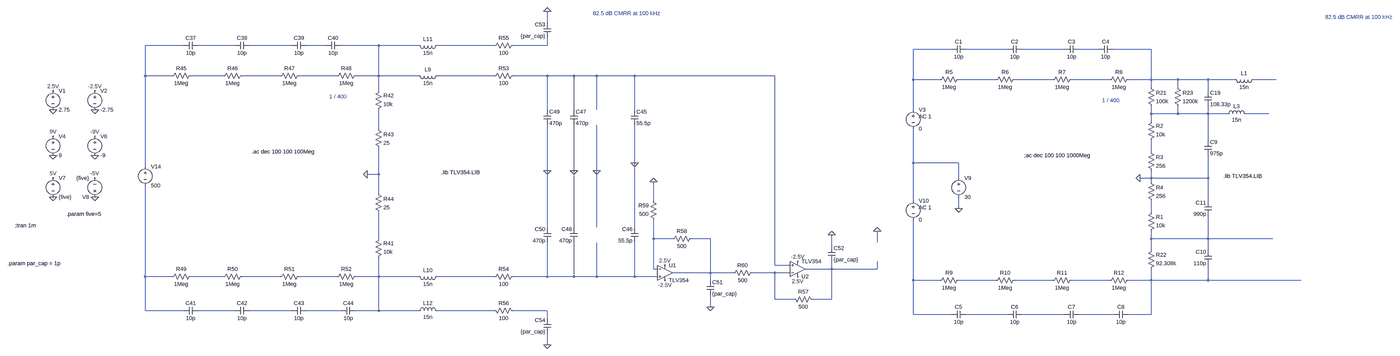
[diagram p0: schematic ratio_analysis_ac.asc, whole sheet]
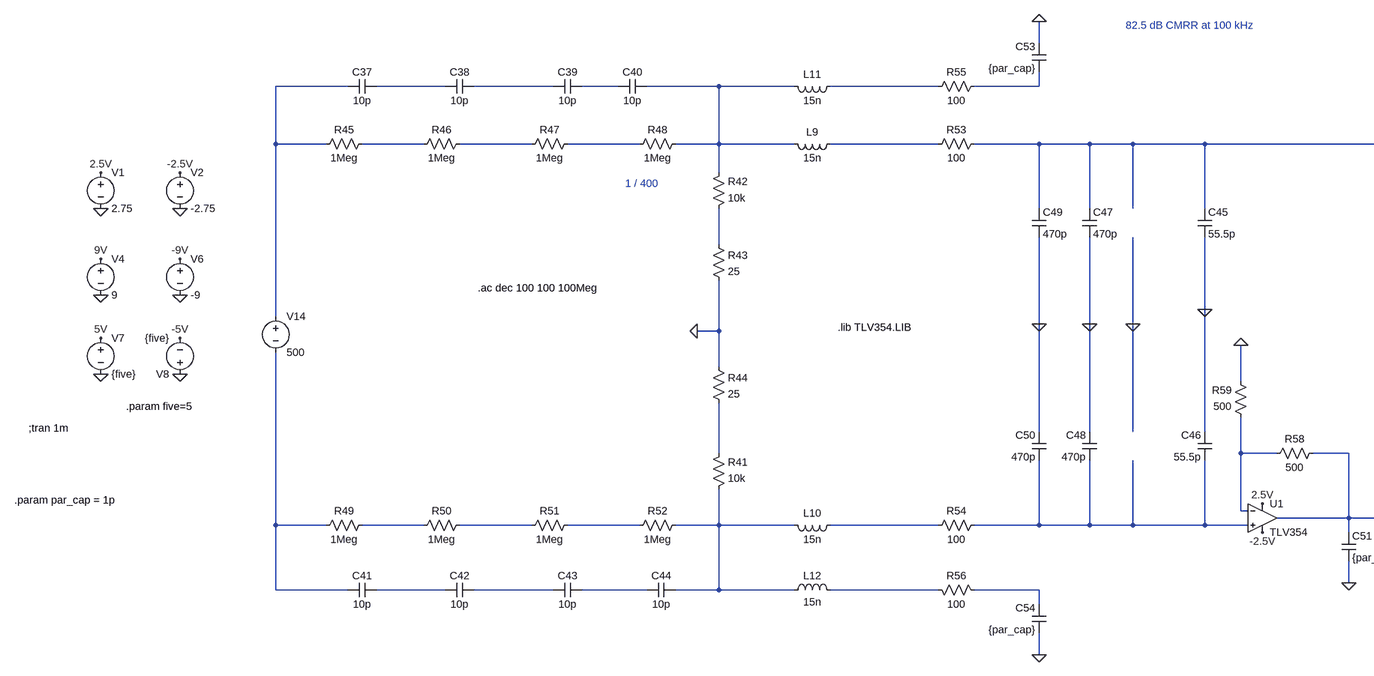
[diagram p1: schematic ratio_analysis_ac.asc, part, row 1 of 1, column 1 of 2]
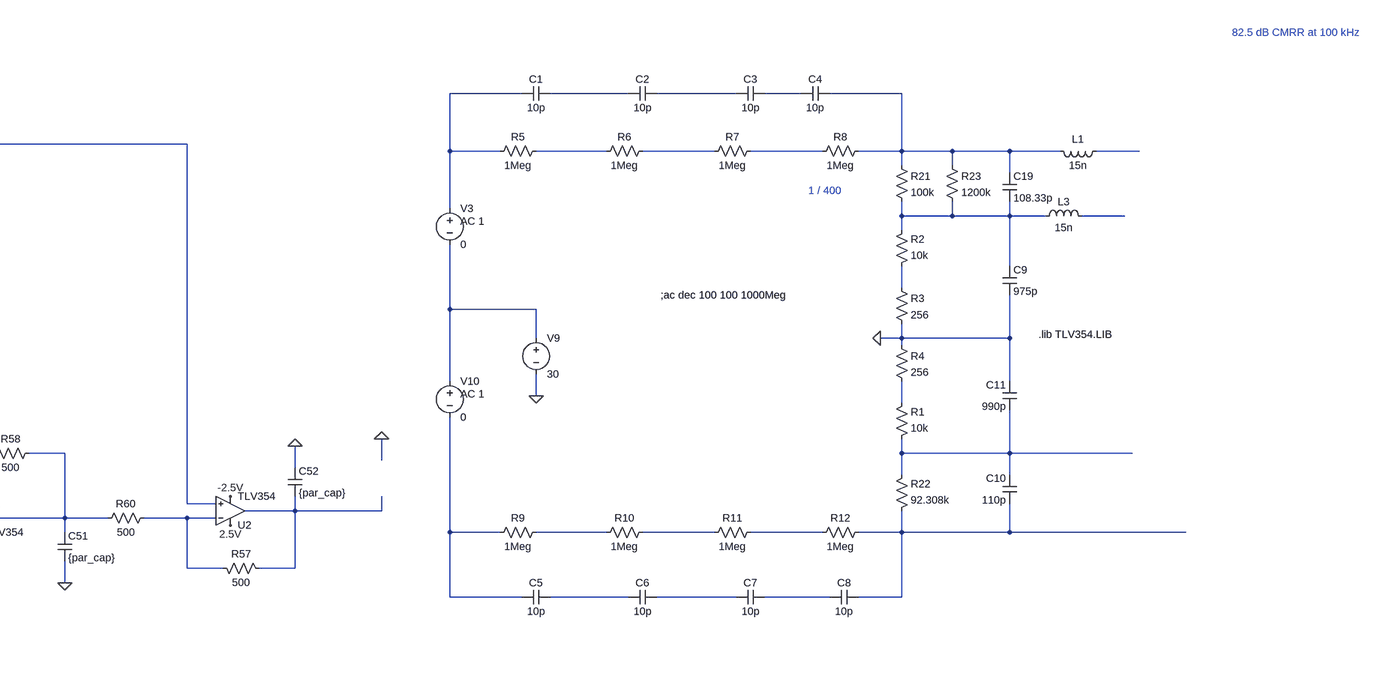
[diagram p2: schematic ratio_analysis_ac.asc, part, row 1 of 1, column 2 of 2]
ratio_analysis_ac.asc, the LTspice schematic file:
Version 4
SHEET 1 7364 2628
WIRE 2144 -544 2144 -592
WIRE 544 -448 384 -448
WIRE 784 -448 608 -448
WIRE 1024 -448 848 -448
WIRE 1168 -448 1088 -448
WIRE 1392 -448 1232 -448
WIRE 1600 -448 1392 -448
WIRE 1920 -448 1680 -448
WIRE 2144 -448 2144 -480
WIRE 2144 -448 2000 -448
WIRE 3936 -432 3776 -432
WIRE 4176 -432 4000 -432
WIRE 4416 -432 4240 -432
WIRE 4560 -432 4480 -432
WIRE 4784 -432 4624 -432
WIRE 384 -320 384 -448
WIRE 496 -320 384 -320
WIRE 736 -320 576 -320
WIRE 976 -320 816 -320
WIRE 1216 -320 1056 -320
WIRE 1392 -320 1392 -448
WIRE 1392 -320 1296 -320
WIRE 1600 -320 1392 -320
WIRE 1920 -320 1680 -320
WIRE 2144 -320 2000 -320
WIRE 2256 -320 2144 -320
WIRE 2352 -320 2256 -320
WIRE 2512 -320 2352 -320
WIRE 3104 -320 2512 -320
WIRE 3776 -304 3776 -432
WIRE 3888 -304 3776 -304
WIRE 4128 -304 3968 -304
WIRE 4368 -304 4208 -304
WIRE 4608 -304 4448 -304
WIRE 4784 -304 4784 -432
WIRE 4784 -304 4688 -304
WIRE 4896 -304 4784 -304
WIRE 5024 -304 4896 -304
WIRE 5136 -304 5024 -304
WIRE 5312 -304 5216 -304
WIRE 4784 -272 4784 -304
WIRE 4896 -272 4896 -304
WIRE 1392 -256 1392 -320
WIRE 5024 -256 5024 -304
WIRE 2144 -176 2144 -320
WIRE 2256 -176 2256 -320
WIRE 2352 -176 2352 -320
WIRE 2512 -176 2512 -320
WIRE 3776 -176 3776 -304
WIRE 4784 -160 4784 -192
WIRE 4896 -160 4896 -192
WIRE 4896 -160 4784 -160
WIRE 5024 -160 5024 -192
WIRE 5024 -160 4896 -160
WIRE 5104 -160 5024 -160
WIRE 5280 -160 5184 -160
WIRE 4784 -128 4784 -160
WIRE 1392 -96 1392 -176
WIRE 5024 -48 5024 -160
WIRE 4784 0 4784 -48
WIRE 2512 48 2512 -112
WIRE 3776 48 3776 -96
WIRE 3968 48 3776 48
WIRE 384 64 384 -320
WIRE 2144 80 2144 -112
WIRE 2256 80 2256 -112
WIRE 2352 80 2352 -112
WIRE 1392 96 1392 -16
WIRE 1392 96 1344 96
WIRE 3968 112 3968 48
WIRE 4784 112 4784 80
WIRE 4784 112 4736 112
WIRE 5024 112 5024 16
WIRE 5024 112 4784 112
WIRE 4784 128 4784 112
WIRE 1392 176 1392 96
WIRE 2592 208 2592 128
WIRE 3776 208 3776 48
WIRE 5024 208 5024 112
WIRE 3968 240 3968 192
WIRE 4784 256 4784 208
WIRE 2144 320 2144 80
WIRE 2256 320 2256 80
WIRE 2352 320 2352 80
WIRE 2512 320 2512 48
WIRE 1392 368 1392 256
WIRE 2592 368 2592 288
WIRE 2672 368 2592 368
WIRE 2832 368 2752 368
WIRE 4784 368 4784 336
WIRE 5024 368 5024 272
WIRE 5024 368 4784 368
WIRE 5296 368 5024 368
WIRE 3536 384 3536 336
WIRE 3344 400 3344 352
WIRE 4784 416 4784 368
WIRE 5024 416 5024 368
WIRE 3104 480 3104 -320
WIRE 3168 480 3104 480
WIRE 2592 496 2592 368
WIRE 2608 496 2592 496
WIRE 3344 496 3344 464
WIRE 3344 496 3232 496
WIRE 3536 496 3536 464
WIRE 3536 496 3344 496
WIRE 2832 512 2832 368
WIRE 2832 512 2672 512
WIRE 2928 512 2832 512
WIRE 3104 512 3008 512
WIRE 3168 512 3104 512
WIRE 384 528 384 144
WIRE 496 528 384 528
WIRE 736 528 576 528
WIRE 976 528 816 528
WIRE 1216 528 1056 528
WIRE 1392 528 1392 448
WIRE 1392 528 1296 528
WIRE 1600 528 1392 528
WIRE 1920 528 1680 528
WIRE 2144 528 2144 384
WIRE 2144 528 2000 528
WIRE 2256 528 2256 384
WIRE 2256 528 2144 528
WIRE 2352 528 2352 384
WIRE 2352 528 2256 528
WIRE 2512 528 2512 384
WIRE 2512 528 2352 528
WIRE 2608 528 2512 528
WIRE 2832 544 2832 512
WIRE 3776 544 3776 288
WIRE 3888 544 3776 544
WIRE 4128 544 3968 544
WIRE 4368 544 4208 544
WIRE 4608 544 4448 544
WIRE 4784 544 4784 496
WIRE 4784 544 4688 544
WIRE 5024 544 5024 480
WIRE 5024 544 4784 544
WIRE 5424 544 5024 544
WIRE 3104 624 3104 512
WIRE 3184 624 3104 624
WIRE 3344 624 3344 496
WIRE 3344 624 3264 624
WIRE 2832 656 2832 608
WIRE 384 672 384 528
WIRE 544 672 384 672
WIRE 784 672 608 672
WIRE 1024 672 848 672
WIRE 1232 672 1088 672
WIRE 1392 672 1392 528
WIRE 1392 672 1296 672
WIRE 1600 672 1392 672
WIRE 1920 672 1680 672
WIRE 2144 672 2000 672
WIRE 3776 688 3776 544
WIRE 3936 688 3776 688
WIRE 4176 688 4000 688
WIRE 4416 688 4240 688
WIRE 4624 688 4480 688
WIRE 4784 688 4784 544
WIRE 4784 688 4688 688
WIRE 2144 704 2144 672
WIRE 2144 816 2144 768
FLAG -80 -176 0
FLAG -80 -256 2.5V
FLAG 96 -176 0
FLAG 96 -256 -2.5V
FLAG -80 16 0
FLAG -80 -64 9V
FLAG 96 16 0
FLAG 96 -64 -9V
FLAG -80 192 0
FLAG -80 112 5V
FLAG 96 192 0
FLAG 96 112 -5V
FLAG 1344 96 0
FLAG 2352 80 0
FLAG 2512 48 0
FLAG 3200 528 2.5V
FLAG 3200 464 -2.5V
FLAG 2256 80 0
FLAG 2640 480 2.5V
FLAG 2640 544 -2.5V
FLAG 2144 80 0
FLAG 2832 656 0
FLAG 3344 352 0
FLAG 2144 -592 0
FLAG 2144 816 0
FLAG 3536 336 0
FLAG 2592 128 0
FLAG 4736 112 0
FLAG 3968 240 0
SYMBOL voltage -80 -272 R0
SYMATTR InstName V1
SYMATTR Value 2.75
SYMBOL voltage 96 -272 R0
SYMATTR InstName V2
SYMATTR Value -2.75
SYMBOL voltage -80 -80 R0
SYMATTR InstName V4
SYMATTR Value 9
SYMBOL voltage 96 -80 R0
SYMATTR InstName V6
SYMATTR Value -9
SYMBOL voltage -80 96 R0
SYMATTR InstName V7
SYMATTR Value {five}
SYMBOL voltage 96 208 R180
WINDOW 123 0 0 Left 0
WINDOW 39 0 0 Left 0
SYMATTR InstName V8
SYMATTR Value {five}
SYMBOL res 1376 464 M180
WINDOW 0 36 76 Left 2
WINDOW 3 36 40 Left 2
SYMATTR InstName R41
SYMATTR Value 10k
SYMBOL cap 608 -464 R90
WINDOW 0 0 32 VBottom 2
WINDOW 3 32 32 VTop 2
SYMATTR InstName C37
SYMATTR Value 10p
SYMBOL cap 848 -464 R90
WINDOW 0 0 32 VBottom 2
WINDOW 3 32 32 VTop 2
SYMATTR InstName C38
SYMATTR Value 10p
SYMBOL cap 1088 -464 R90
WINDOW 0 0 32 VBottom 2
WINDOW 3 32 32 VTop 2
SYMATTR InstName C39
SYMATTR Value 10p
SYMBOL cap 1232 -464 R90
WINDOW 0 0 32 VBottom 2
WINDOW 3 32 32 VTop 2
SYMATTR InstName C40
SYMATTR Value 10p
SYMBOL cap 608 656 R90
WINDOW 0 0 32 VBottom 2
WINDOW 3 32 32 VTop 2
SYMATTR InstName C41
SYMATTR Value 10p
SYMBOL cap 848 656 R90
WINDOW 0 0 32 VBottom 2
WINDOW 3 32 32 VTop 2
SYMATTR InstName C42
SYMATTR Value 10p
SYMBOL cap 1088 656 R90
WINDOW 0 0 32 VBottom 2
WINDOW 3 32 32 VTop 2
SYMATTR InstName C43
SYMATTR Value 10p
SYMBOL cap 1296 656 R90
WINDOW 0 0 32 VBottom 2
WINDOW 3 32 32 VTop 2
SYMATTR InstName C44
SYMATTR Value 10p
SYMBOL cap 2496 -176 R0
SYMATTR InstName C45
SYMATTR Value 55.5p
SYMBOL cap 2528 384 R180
WINDOW 0 24 56 Left 2
WINDOW 3 24 8 Left 2
SYMATTR InstName C46
SYMATTR Value 55.5p
SYMBOL res 1376 -160 M180
WINDOW 0 36 76 Left 2
WINDOW 3 36 40 Left 2
SYMATTR InstName R42
SYMATTR Value 10k
SYMBOL voltage 384 48 R0
WINDOW 123 0 0 Left 0
WINDOW 39 0 0 Left 0
SYMATTR InstName V14
SYMATTR Value 500
SYMBOL cap 2240 -176 R0
SYMATTR InstName C47
SYMATTR Value 470p
SYMBOL cap 2272 384 R180
WINDOW 0 24 56 Left 2
WINDOW 3 24 8 Left 2
SYMATTR InstName C48
SYMATTR Value 470p
SYMBOL res 1376 -112 R0
SYMATTR InstName R43
SYMATTR Value 25
SYMBOL res 1376 160 R0
SYMATTR InstName R44
SYMATTR Value 25
SYMBOL cap 2128 -176 R0
SYMATTR InstName C49
SYMATTR Value 470p
SYMBOL cap 2160 384 R180
WINDOW 0 24 56 Left 2
WINDOW 3 24 8 Left 2
SYMATTR InstName C50
SYMATTR Value 470p
SYMBOL cap 2816 544 R0
SYMATTR InstName C51
SYMATTR Value {par_cap}
SYMBOL cap 3328 464 M180
WINDOW 0 24 56 Left 2
WINDOW 3 24 8 Left 2
SYMATTR InstName C52
SYMATTR Value {par_cap}
SYMBOL ind 1696 -336 R90
WINDOW 0 5 56 VBottom 2
WINDOW 3 32 56 VTop 2
SYMATTR InstName L9
SYMATTR Value 15n
SYMBOL res 592 -336 R90
WINDOW 0 0 56 VBottom 2
WINDOW 3 32 56 VTop 2
SYMATTR InstName R45
SYMATTR Value 1Meg
SYMBOL res 832 -336 R90
WINDOW 0 0 56 VBottom 2
WINDOW 3 32 56 VTop 2
SYMATTR InstName R46
SYMATTR Value 1Meg
SYMBOL res 1072 -336 R90
WINDOW 0 0 56 VBottom 2
WINDOW 3 32 56 VTop 2
SYMATTR InstName R47
SYMATTR Value 1Meg
SYMBOL res 1312 -336 R90
WINDOW 0 0 56 VBottom 2
WINDOW 3 32 56 VTop 2
SYMATTR InstName R48
SYMATTR Value 1Meg
SYMBOL res 592 512 R90
WINDOW 0 0 56 VBottom 2
WINDOW 3 32 56 VTop 2
SYMATTR InstName R49
SYMATTR Value 1Meg
SYMBOL res 832 512 R90
WINDOW 0 0 56 VBottom 2
WINDOW 3 32 56 VTop 2
SYMATTR InstName R50
SYMATTR Value 1Meg
SYMBOL res 1072 512 R90
WINDOW 0 0 56 VBottom 2
WINDOW 3 32 56 VTop 2
SYMATTR InstName R51
SYMATTR Value 1Meg
SYMBOL res 1312 512 R90
WINDOW 0 0 56 VBottom 2
WINDOW 3 32 56 VTop 2
SYMATTR InstName R52
SYMATTR Value 1Meg
SYMBOL ind 1696 512 R90
WINDOW 0 5 56 VBottom 2
WINDOW 3 32 56 VTop 2
SYMATTR InstName L10
SYMATTR Value 15n
SYMBOL res 2016 -336 R90
WINDOW 0 0 56 VBottom 2
WINDOW 3 32 56 VTop 2
SYMATTR InstName R53
SYMATTR Value 100
SYMBOL res 2016 512 R90
WINDOW 0 0 56 VBottom 2
WINDOW 3 32 56 VTop 2
SYMATTR InstName R54
SYMATTR Value 100
SYMBOL ind 1696 -464 R90
WINDOW 0 5 56 VBottom 2
WINDOW 3 32 56 VTop 2
SYMATTR InstName L11
SYMATTR Value 15n
SYMBOL res 2016 -464 R90
WINDOW 0 0 56 VBottom 2
WINDOW 3 32 56 VTop 2
SYMATTR InstName R55
SYMATTR Value 100
SYMBOL cap 2160 -480 R180
WINDOW 0 24 56 Left 2
WINDOW 3 24 8 Left 2
SYMATTR InstName C53
SYMATTR Value {par_cap}
SYMBOL ind 1696 688 M270
WINDOW 0 32 56 VTop 2
WINDOW 3 5 56 VBottom 2
SYMATTR InstName L12
SYMATTR Value 15n
SYMBOL res 2016 688 M270
WINDOW 0 32 56 VTop 2
WINDOW 3 0 56 VBottom 2
SYMATTR InstName R56
SYMATTR Value 100
SYMBOL cap 2160 704 M0
SYMATTR InstName C54
SYMATTR Value {par_cap}
SYMBOL res 3280 640 M270
WINDOW 0 32 56 VTop 2
WINDOW 3 0 56 VBottom 2
SYMATTR InstName R57
SYMATTR Value 500
SYMBOL res 2768 352 R90
WINDOW 0 0 56 VBottom 2
WINDOW 3 32 56 VTop 2
SYMATTR InstName R58
SYMATTR Value 500
SYMBOL res 2608 304 R180
WINDOW 0 36 76 Left 2
WINDOW 3 36 40 Left 2
SYMATTR InstName R59
SYMATTR Value 500
SYMBOL res 3024 496 R90
WINDOW 0 0 56 VBottom 2
WINDOW 3 32 56 VTop 2
SYMATTR InstName R60
SYMATTR Value 500
SYMBOL OpAmps\\opamp2 2640 448 R0
SYMATTR InstName U1
SYMATTR Value TLV354
SYMBOL OpAmps\\opamp2 3200 560 M180
SYMATTR InstName U2
SYMATTR Value TLV354
SYMBOL res 4768 352 M180
WINDOW 0 36 76 Left 2
WINDOW 3 36 40 Left 2
SYMATTR InstName R1
SYMATTR Value 10k
SYMBOL cap 4000 -448 R90
WINDOW 0 0 32 VBottom 2
WINDOW 3 32 32 VTop 2
SYMATTR InstName C1
SYMATTR Value 10p
SYMBOL cap 4240 -448 R90
WINDOW 0 0 32 VBottom 2
WINDOW 3 32 32 VTop 2
SYMATTR InstName C2
SYMATTR Value 10p
SYMBOL cap 4480 -448 R90
WINDOW 0 0 32 VBottom 2
WINDOW 3 32 32 VTop 2
SYMATTR InstName C3
SYMATTR Value 10p
SYMBOL cap 4624 -448 R90
WINDOW 0 0 32 VBottom 2
WINDOW 3 32 32 VTop 2
SYMATTR InstName C4
SYMATTR Value 10p
SYMBOL cap 4000 672 R90
WINDOW 0 0 32 VBottom 2
WINDOW 3 32 32 VTop 2
SYMATTR InstName C5
SYMATTR Value 10p
SYMBOL cap 4240 672 R90
WINDOW 0 0 32 VBottom 2
WINDOW 3 32 32 VTop 2
SYMATTR InstName C6
SYMATTR Value 10p
SYMBOL cap 4480 672 R90
WINDOW 0 0 32 VBottom 2
WINDOW 3 32 32 VTop 2
SYMATTR InstName C7
SYMATTR Value 10p
SYMBOL cap 4688 672 R90
WINDOW 0 0 32 VBottom 2
WINDOW 3 32 32 VTop 2
SYMATTR InstName C8
SYMATTR Value 10p
SYMBOL res 4768 -32 M180
WINDOW 0 36 76 Left 2
WINDOW 3 36 40 Left 2
SYMATTR InstName R2
SYMATTR Value 10k
SYMBOL voltage 3776 -192 R0
WINDOW 123 24 44 Left 2
WINDOW 39 0 0 Left 0
SYMATTR Value2 AC 1
SYMATTR InstName V3
SYMATTR Value 0
SYMBOL res 4768 -16 R0
SYMATTR InstName R3
SYMATTR Value 256
SYMBOL ind 5232 -320 R90
WINDOW 0 5 56 VBottom 2
WINDOW 3 32 56 VTop 2
SYMATTR InstName L1
SYMATTR Value 15n
SYMBOL res 3984 -320 R90
WINDOW 0 0 56 VBottom 2
WINDOW 3 32 56 VTop 2
SYMATTR InstName R5
SYMATTR Value 1Meg
SYMBOL res 4224 -320 R90
WINDOW 0 0 56 VBottom 2
WINDOW 3 32 56 VTop 2
SYMATTR InstName R6
SYMATTR Value 1Meg
SYMBOL res 4464 -320 R90
WINDOW 0 0 56 VBottom 2
WINDOW 3 32 56 VTop 2
SYMATTR InstName R7
SYMATTR Value 1Meg
SYMBOL res 4704 -320 R90
WINDOW 0 0 56 VBottom 2
WINDOW 3 32 56 VTop 2
SYMATTR InstName R8
SYMATTR Value 1Meg
SYMBOL res 3984 528 R90
WINDOW 0 0 56 VBottom 2
WINDOW 3 32 56 VTop 2
SYMATTR InstName R9
SYMATTR Value 1Meg
SYMBOL res 4224 528 R90
WINDOW 0 0 56 VBottom 2
WINDOW 3 32 56 VTop 2
SYMATTR InstName R10
SYMATTR Value 1Meg
SYMBOL res 4464 528 R90
WINDOW 0 0 56 VBottom 2
WINDOW 3 32 56 VTop 2
SYMATTR InstName R11
SYMATTR Value 1Meg
SYMBOL res 4704 528 R90
WINDOW 0 0 56 VBottom 2
WINDOW 3 32 56 VTop 2
SYMATTR InstName R12
SYMATTR Value 1Meg
SYMBOL ind 5200 -144 M270
WINDOW 0 32 56 VTop 2
WINDOW 3 5 56 VBottom 2
SYMATTR InstName L3
SYMATTR Value 15n
SYMBOL voltage 3968 96 R0
WINDOW 123 0 0 Left 0
WINDOW 39 0 0 Left 0
SYMATTR InstName V9
SYMATTR Value 30
SYMBOL res 4768 112 R0
SYMATTR InstName R4
SYMATTR Value 256
SYMBOL res 4768 512 M180
WINDOW 0 36 76 Left 2
WINDOW 3 36 40 Left 2
SYMATTR InstName R22
SYMATTR Value 92.308k
SYMBOL res 4768 -288 R0
SYMATTR InstName R21
SYMATTR Value 100k
SYMBOL res 4880 -288 R0
SYMATTR InstName R23
SYMATTR Value 1200k
SYMBOL cap 5008 -256 R0
SYMATTR InstName C19
SYMATTR Value 108.33p
SYMBOL cap 5008 -48 R0
SYMATTR InstName C9
SYMATTR Value 975p
SYMBOL cap 5040 480 R180
WINDOW 0 24 56 Left 2
WINDOW 3 24 8 Left 2
SYMATTR InstName C10
SYMATTR Value 110p
SYMBOL cap 5040 272 R180
WINDOW 0 24 56 Left 2
WINDOW 3 24 8 Left 2
SYMATTR InstName C11
SYMATTR Value 990p
SYMBOL voltage 3776 192 R0
WINDOW 123 24 44 Left 2
WINDOW 39 0 0 Left 0
SYMATTR Value2 AC 1
SYMATTR InstName V10
SYMATTR Value 0
TEXT -240 312 Left 2 !;tran 1m
TEXT -24 264 Left 2 !.param five=5
TEXT -272 472 Left 2 !.param par_cap = 1p
TEXT 1184 -232 Left 2 ;1 / 400
TEXT 2336 -584 Left 2 ;82.5 dB CMRR at 100 kHz
TEXT 856 0 Left 2 !.ac dec 100 100 100Meg
TEXT 1696 88 Left 2 !.lib TLV354.LIB
TEXT 4576 -216 Left 2 ;1 / 400
TEXT 5728 -568 Left 2 ;82.5 dB CMRR at 100 kHz
TEXT 4248 16 Left 2 !;ac dec 100 100 1000Meg
TEXT 5088 104 Left 2 !.lib TLV354.LIB

The netlist it stands for:
* ratio_analysis_ac.asc
V1 2.5V 0 2.75
V2 -2.5V 0 -2.75
V4 9V 0 9
V6 -9V 0 -9
V7 5V 0 {five}
V8 0 -5V {five}
R41 N038 N028 10k
C37 N002 N001 10p
C38 N003 N002 10p
C39 N004 N003 10p
C40 N005 N004 10p
C41 N046 N034 10p
C42 N047 N046 10p
C43 N048 N047 10p
C44 N038 N048 10p
C45 N017 0 55.5p
C46 N040 0 55.5p
R42 N024 N005 10k
V14 N001 N034 500
C47 N017 0 470p
C48 N040 0 470p
R43 N024 0 25
R44 0 N028 25
C49 N017 0 470p
C50 N040 0 470p
C51 N030 0 {par_cap}
C52 N032 0 {par_cap}
L9 N016 N005 15n
R45 N013 N001 1Meg
R46 N014 N013 1Meg
R47 N015 N014 1Meg
R48 N005 N015 1Meg
R49 N035 N034 1Meg
R50 N036 N035 1Meg
R51 N037 N036 1Meg
R52 N038 N037 1Meg
L10 N039 N038 15n
R53 N017 N016 100
R54 N040 N039 100
L11 N006 N005 15n
R55 N007 N006 100
C53 N007 0 {par_cap}
L12 N049 N038 15n
R56 N050 N049 100
C54 N050 0 {par_cap}
R57 N032 N033 500
R58 N030 N029 500
R59 N029 0 500
R60 N033 N030 500
XU1 N040 N029 2.5V -2.5V N030 TLV354  ; pins In+ In- V+ V- OUT
XU2 N017 N033 2.5V -2.5V N032 TLV354  ; pins In+ In- V+ V- OUT
R1 N031 N027 10k
C1 N009 N008 10p
C2 N010 N009 10p
C3 N011 N010 10p
C4 N012 N011 10p
C5 N051 N041 10p
C6 N052 N051 10p
C7 N053 N052 10p
C8 N045 N053 10p
R2 N025 N022 10k
V3 N008 N026 0 AC 1
R3 N025 0 256
L1 N021 N012 15n
R5 N018 N008 1Meg
R6 N019 N018 1Meg
R7 N020 N019 1Meg
R8 N012 N020 1Meg
R9 N042 N041 1Meg
R10 N043 N042 1Meg
R11 N044 N043 1Meg
R12 N045 N044 1Meg
L3 N023 N022 15n
V9 N026 0 30
R4 0 N027 256
R22 N045 N031 92.308k
R21 N012 N022 100k
R23 N012 N022 1200k
C19 N012 N022 108.33p
C9 N022 0 975p
C10 N045 N031 110p
C11 N031 0 990p
V10 N026 N041 0 AC 1
;tran 1m
.param five=5
.param par_cap = 1p
* 1 / 400
* 82.5 dB CMRR at 100 kHz
.ac dec 100 100 100Meg
.lib TLV354.LIB
* 1 / 400
* 82.5 dB CMRR at 100 kHz
;ac dec 100 100 1000Meg
.lib TLV354.LIB
.backanno
.end